# EAGLE schematic bms_108_Cell (EAGLE 6.2), part 2 of 2
## Sheet 7 of 9
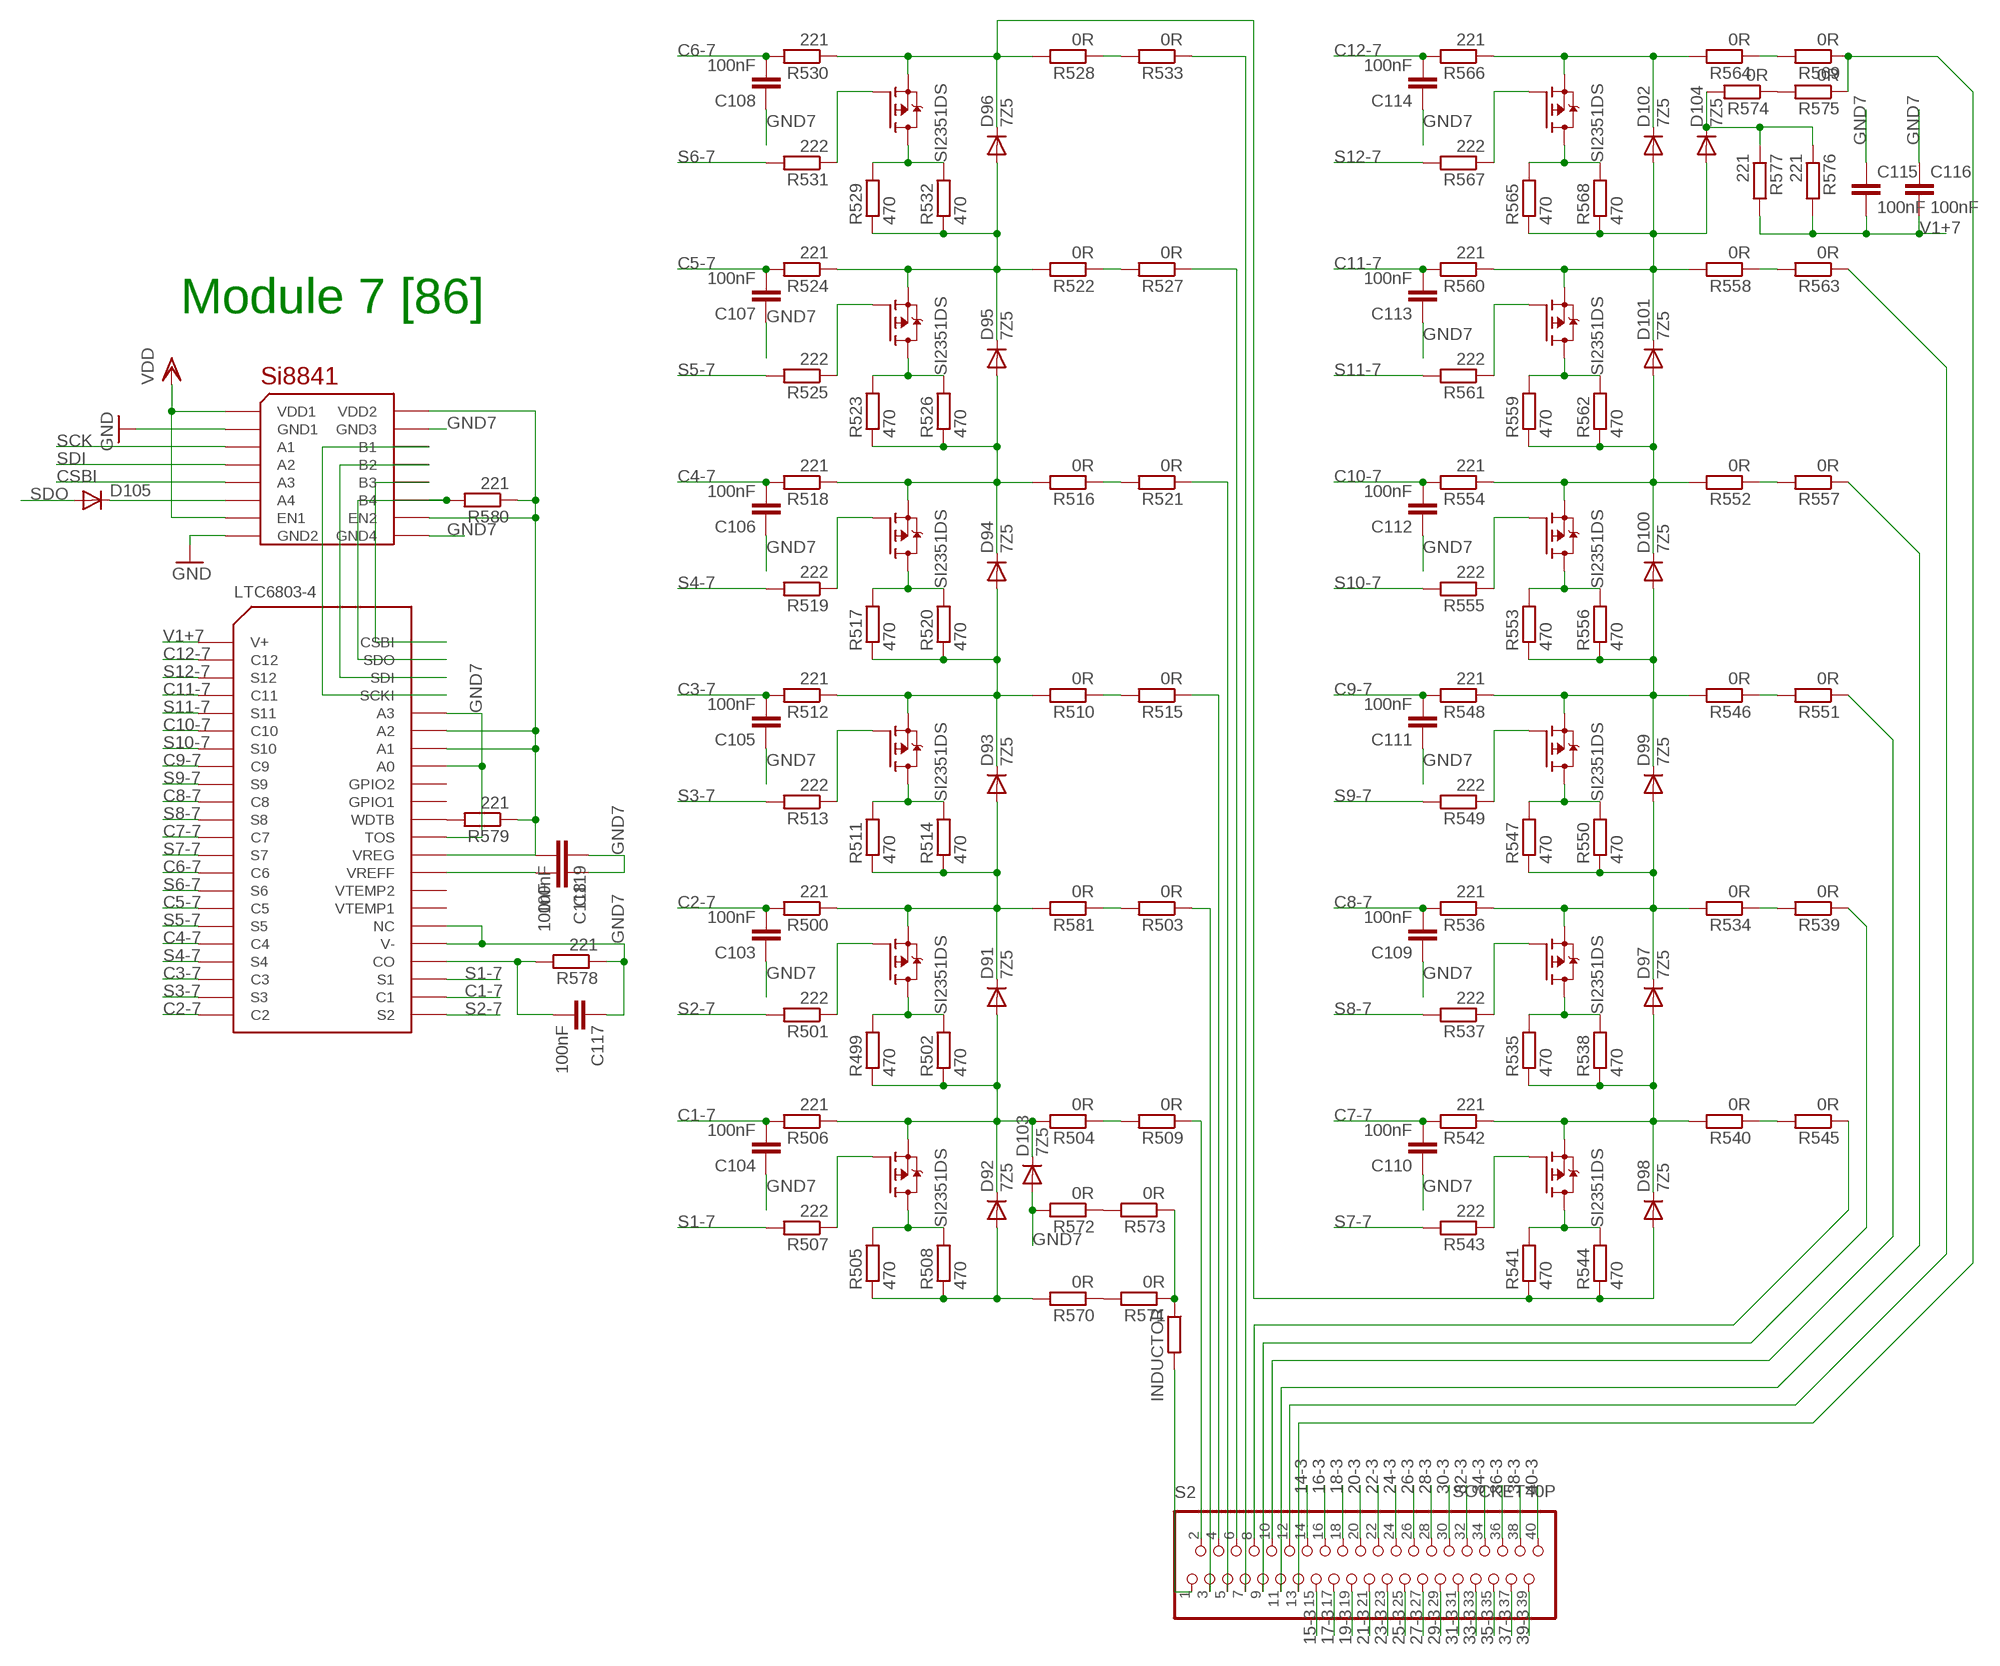
[diagram p6: schematic, sheet 7]

### Parts
C103  100nF  C-EUC0805K  [C0805K]
C104  100nF  C-EUC0805K  [C0805K]
C105  100nF  C-EUC0805K  [C0805K]
C106  100nF  C-EUC0805K  [C0805K]
C107  100nF  C-EUC0805K  [C0805K]
C108  100nF  C-EUC0805K  [C0805K]
C109  100nF  C-EUC0805K  [C0805K]
C110  100nF  C-EUC0805K  [C0805K]
C111  100nF  C-EUC0805K  [C0805K]
C112  100nF  C-EUC0805K  [C0805K]
C113  100nF  C-EUC0805K  [C0805K]
C114  100nF  C-EUC0805K  [C0805K]
C115  100nF  C-EUC0805K  [C0805K]
C116  100nF  C-EUC0805K  [C0805K]
C117  100nF  C-EUC0805K  [C0805K]
C118  100nF  C-EUC0805K  [C0805K]
C119  100nF  C-EUC0805K  [C0805K]
D91  7Z5  DIODE-SMB  [SMB]
D92  7Z5  DIODE-SMB  [SMB]
D93  7Z5  DIODE-SMB  [SMB]
D94  7Z5  DIODE-SMB  [SMB]
D95  7Z5  DIODE-SMB  [SMB]
D96  7Z5  DIODE-SMB  [SMB]
D97  7Z5  DIODE-SMB  [SMB]
D98  7Z5  DIODE-SMB  [SMB]
D99  7Z5  DIODE-SMB  [SMB]
D100  7Z5  DIODE-SMB  [SMB]
D101  7Z5  DIODE-SMB  [SMB]
D102  7Z5  DIODE-SMB  [SMB]
D103  7Z5  DIODE-SMB  [SMB]
D104  7Z5  DIODE-SMB  [SMB]
D105  DIODE-SOD123  [SOD123]
R499  470  R-EU_R6332  [R6332]
R500  221  R-EU_R0805  [R0805]
R501  222  R-EU_R0805  [R0805]
R502  470  R-EU_R6332  [R6332]
R503  0R  R-EU_M1206  [M1206]
R504  0R  R-EU_M1206  [M1206]
R505  470  R-EU_R6332  [R6332]
R506  221  R-EU_R0805  [R0805]
R507  222  R-EU_R0805  [R0805]
R508  470  R-EU_R6332  [R6332]
R509  0R  R-EU_M1206  [M1206]
R510  0R  R-EU_M1206  [M1206]
R511  470  R-EU_R6332  [R6332]
R512  221  R-EU_R0805  [R0805]
R513  222  R-EU_R0805  [R0805]
R514  470  R-EU_R6332  [R6332]
R515  0R  R-EU_M1206  [M1206]
R516  0R  R-EU_M1206  [M1206]
R517  470  R-EU_R6332  [R6332]
R518  221  R-EU_R0805  [R0805]
R519  222  R-EU_R0805  [R0805]
R520  470  R-EU_R6332  [R6332]
R521  0R  R-EU_M1206  [M1206]
R522  0R  R-EU_M1206  [M1206]
R523  470  R-EU_R6332  [R6332]
R524  221  R-EU_R0805  [R0805]
R525  222  R-EU_R0805  [R0805]
R526  470  R-EU_R6332  [R6332]
R527  0R  R-EU_M1206  [M1206]
R528  0R  R-EU_M1206  [M1206]
R529  470  R-EU_R6332  [R6332]
R530  221  R-EU_R0805  [R0805]
R531  222  R-EU_R0805  [R0805]
R532  470  R-EU_R6332  [R6332]
R533  0R  R-EU_M1206  [M1206]
R534  0R  R-EU_M1206  [M1206]
R535  470  R-EU_R6332  [R6332]
R536  221  R-EU_R0805  [R0805]
R537  222  R-EU_R0805  [R0805]
R538  470  R-EU_R6332  [R6332]
R539  0R  R-EU_M1206  [M1206]
R540  0R  R-EU_M1206  [M1206]
R541  470  R-EU_R6332  [R6332]
R542  221  R-EU_R0805  [R0805]
R543  222  R-EU_R0805  [R0805]
R544  470  R-EU_R6332  [R6332]
R545  0R  R-EU_M1206  [M1206]
R546  0R  R-EU_M1206  [M1206]
R547  470  R-EU_R6332  [R6332]
R548  221  R-EU_R0805  [R0805]
R549  222  R-EU_R0805  [R0805]
R550  470  R-EU_R6332  [R6332]
R551  0R  R-EU_M1206  [M1206]
R552  0R  R-EU_M1206  [M1206]
R553  470  R-EU_R6332  [R6332]
R554  221  R-EU_R0805  [R0805]
R555  222  R-EU_R0805  [R0805]
R556  470  R-EU_R6332  [R6332]
R557  0R  R-EU_M1206  [M1206]
R558  0R  R-EU_M1206  [M1206]
R559  470  R-EU_R6332  [R6332]
R560  221  R-EU_R0805  [R0805]
R561  222  R-EU_R0805  [R0805]
R562  470  R-EU_R6332  [R6332]
R563  0R  R-EU_M1206  [M1206]
R564  0R  R-EU_M1206  [M1206]
R565  470  R-EU_R6332  [R6332]
R566  221  R-EU_R0805  [R0805]
R567  222  R-EU_R0805  [R0805]
R568  470  R-EU_R6332  [R6332]
R569  0R  R-EU_M1206  [M1206]
R570  0R  R-EU_M1206  [M1206]
R571  0R  R-EU_M1206  [M1206]
R572  0R  R-EU_M1206  [M1206]
R573  0R  R-EU_M1206  [M1206]
R574  0R  R-EU_M1206  [M1206]
R575  0R  R-EU_M1206  [M1206]
R576  221  R-EU_R0805  [R0805]
R577  221  R-EU_R0805  [R0805]
R578  221  R-EU_R0805  [R0805]
R579  221  R-EU_R0805  [R0805]
R580  221  R-EU_R0805  [R0805]
R581  0R  R-EU_M1206  [M1206]
S2  SOCKET40P  [40PIN]
U$91  LTC6803-4  [SSOP44]
U$92  SI8841  [SO16]
U$93  SI2351DS  [SOT23]
U$94  SI2351DS  [SOT23]
U$95  SI2351DS  [SOT23]
U$96  SI2351DS  [SOT23]
U$97  SI2351DS  [SOT23]
U$98  SI2351DS  [SOT23]
U$99  SI2351DS  [SOT23]
U$100  SI2351DS  [SOT23]
U$101  SI2351DS  [SOT23]
U$102  SI2351DS  [SOT23]
U$103  SI2351DS  [SOT23]
U$104  SI2351DS  [SOT23]
U$105  INDUCTOR  [L2012C]

### Nets
14-3: S2.14 ; also sheet 8
15-3: S2.15 ; also sheet 8
16-3: S2.16 ; also sheet 8
17-3: S2.17 ; also sheet 8
18-3: S2.18 ; also sheet 8
19-3: S2.19 ; also sheet 8
20-3: S2.20 ; also sheet 8
21-3: S2.21 ; also sheet 8
22-3: S2.22 ; also sheet 8
23-3: S2.23 ; also sheet 8
24-3: S2.24 ; also sheet 8
25-3: S2.25 ; also sheet 8
26-3: S2.26 ; also sheet 8
27-3: S2.27
28-3: S2.28 ; also sheet 9
29-3: S2.29 ; also sheet 9
30-3: S2.30 ; also sheet 9
31-3: S2.31 ; also sheet 9
32-3: S2.32 ; also sheet 9
33-3: S2.33 ; also sheet 9
34-3: S2.34 ; also sheet 9
35-3: S2.35 ; also sheet 9
36-3: S2.36 ; also sheet 9
37-3: S2.37 ; also sheet 9
38-3: S2.38 ; also sheet 9
39-3: S2.39 ; also sheet 9
40-3: S2.40 ; also sheet 9
C1-7: C104.2 R506.2 U$91.24(C1)
C2-7: C103.2 R500.2 U$91.P$22(C2)
C3-7: C105.2 R512.2 U$91.P$20(C3)
C4-7: C106.2 R518.2 U$91.P$18(C4)
C5-7: C107.2 R524.2 U$91.P$16(C5)
C6-7: C108.2 R530.2 U$91.P$14(C6)
C7-7: C110.2 R542.2 U$91.P$12(C7)
C8-7: C109.2 R536.2 U$91.P$10(C8)
C9-7: C111.2 R548.2 U$91.P$8(C9)
C10-7: C112.2 R554.2 U$91.P$6(C10)
C11-7: C113.2 R560.2 U$91.P$4(C11)
C12-7: C114.2 R566.2 U$91.P$2(C12)
CSBI: U$92.5(A3) ; also sheet 1,2,3,4,5,6,8,9
GND: U$92.2(GND1) U$92.8(GND2) ; also sheet 1,2,3,4,5,6,8,9
GND7: C103.1 C104.1 C105.1 C106.1 C107.1 C108.1 C109.1 C110.1 C111.1 C112.1 C113.1 C114.1 C115.1 C116.1 C117.1 C118.1 C119.1 D103.A R572.2 R578.1 U$91.27(V-) U$91.28(NC) U$91.33(TOS) U$91.37(A0) U$91.40(A3) U$92.9(GND4) U$92.15(GND3)
N$405: R501.1 U$93.1(G)
N$406: R499.2 R502.2 U$93.3(D)
N$407: D91.A D92.C D103.C R499.1 R502.1 R504.2 R506.1 U$94.2(S)
N$408: R503.2 R581.1
N$409: R507.1 U$94.1(G)
N$410: R505.2 R508.2 U$94.3(D)
N$411: R504.1 R509.2
N$412: R513.1 U$95.1(G)
N$413: R511.2 R514.2 U$95.3(D)
N$414: D91.C D93.A R500.1 R511.1 R514.1 R581.2 U$93.2(S)
N$415: R510.1 R515.2
N$416: R519.1 U$96.1(G)
N$417: R517.2 R520.2 U$96.3(D)
N$418: D93.C D94.A R510.2 R512.1 R517.1 R520.1 U$95.2(S)
N$419: R516.1 R521.2
N$420: R525.1 U$97.1(G)
N$421: R523.2 R526.2 U$97.3(D)
N$422: D94.C D95.A R516.2 R518.1 R523.1 R526.1 U$96.2(S)
N$423: R522.1 R527.2
N$424: R531.1 U$98.1(G)
N$425: R529.2 R532.2 U$98.3(D)
N$426: D95.C D96.A R522.2 R524.1 R529.1 R532.1 U$97.2(S)
N$427: R528.1 R533.2
N$428: R537.1 U$99.1(G)
N$429: R535.2 R538.2 U$99.3(D)
N$430: D97.A D98.C R535.1 R538.1 R540.2 R542.1 U$100.2(S)
N$431: R534.1 R539.2
N$432: R543.1 U$100.1(G)
N$433: R541.2 R544.2 U$100.3(D)
N$434: D96.C D98.A R528.2 R530.1 R541.1 R544.1 U$98.2(S)
N$435: R540.1 R545.2
N$436: R549.1 U$101.1(G)
N$437: R547.2 R550.2 U$101.3(D)
N$438: D97.C D99.A R534.2 R536.1 R547.1 R550.1 U$99.2(S)
N$439: R546.1 R551.2
N$440: R555.1 U$102.1(G)
N$441: R553.2 R556.2 U$102.3(D)
N$442: D99.C D100.A R546.2 R548.1 R553.1 R556.1 U$101.2(S)
N$443: R552.1 R557.2
N$444: R561.1 U$103.1(G)
N$445: R559.2 R562.2 U$103.3(D)
N$446: D100.C D101.A R552.2 R554.1 R559.1 R562.1 U$102.2(S)
N$447: R558.1 R563.2
N$448: D102.C R564.2 R566.1 U$104.2(S)
N$449: R567.1 U$104.1(G)
N$450: R565.2 R568.2 U$104.3(D)
N$451: D101.C D102.A D104.A R558.2 R560.1 R565.1 R568.1 U$103.2(S)
N$452: R564.1 R569.2
N$453: R570.1 R571.2
N$454: R571.1 R573.1 U$105.1
N$455: D92.A R505.1 R508.1 R570.2
N$456: R572.1 R573.2
N$457: R574.1 R575.2
N$458: D104.C R574.2 R576.1 R577.1
N$459: R569.1 R575.1 S2.13
N$460: C117.2 R578.2 U$91.26(CO)
N$461: C118.2 U$91.31(VREFF)
N$462: C119.2 R579.1 R580.1 U$91.32(VREG) U$91.38(A1) U$91.39(A2) U$92.10(EN2) U$92.16(VDD2)
N$463: R579.2 U$91.34(WDTB)
N$464: R580.2 U$91.43(SDO) U$92.11(B4)
N$465: U$91.44(CSBI) U$92.12(B3)
N$466: U$91.42(SDI) U$92.13(B2)
N$467: U$91.41(SCKI) U$92.14(B1)
N$468: S2.1 U$105.2
N$469: R509.1 S2.2
N$470: R503.1 S2.3
N$471: R515.1 S2.4
N$472: R521.1 S2.5
N$473: R527.1 S2.6
N$474: R533.1 S2.7
N$475: R545.1 S2.8
N$476: R539.1 S2.9
N$477: R551.1 S2.10
N$478: R557.1 S2.11
N$479: R563.1 S2.12
N$480: D105.C U$92.6(A4)
S1-7: R507.2 U$91.25(S1)
S2-7: R501.2 U$91.23(S2)
S3-7: R513.2 U$91.P$21(S3)
S4-7: R519.2 U$91.P$19(S4)
S5-7: R525.2 U$91.P$17(S5)
S6-7: R531.2 U$91.P$15(S6)
S7-7: R543.2 U$91.P$13(S7)
S8-7: R537.2 U$91.P$11(S8)
S9-7: R549.2 U$91.P$9(S9)
S10-7: R555.2 U$91.P$7(S10)
S11-7: R561.2 U$91.P$5(S11)
S12-7: R567.2 U$91.P$3(S12)
SCK: U$92.3(A1) ; also sheet 1,2,3,4,5,6,8,9
SDI: U$92.4(A2) ; also sheet 1,2,3,4,5,6,8,9
SDO: D105.A ; also sheet 1,2,3,4,5,6,8,9
V1+7: C115.2 C116.2 R576.2 R577.2 U$91.P$1(V+)
VDD: U$92.1(VDD1) U$92.7(EN1) ; also sheet 1,2,3,4,5,6,8,9
Unconnected: U$91.29(VTEMP1) U$91.30(VTEMP2) U$91.35(GPIO1) U$91.36(GPIO2)

### Notes on the sheet
- Module 7 [86]

## Sheet 8 of 9
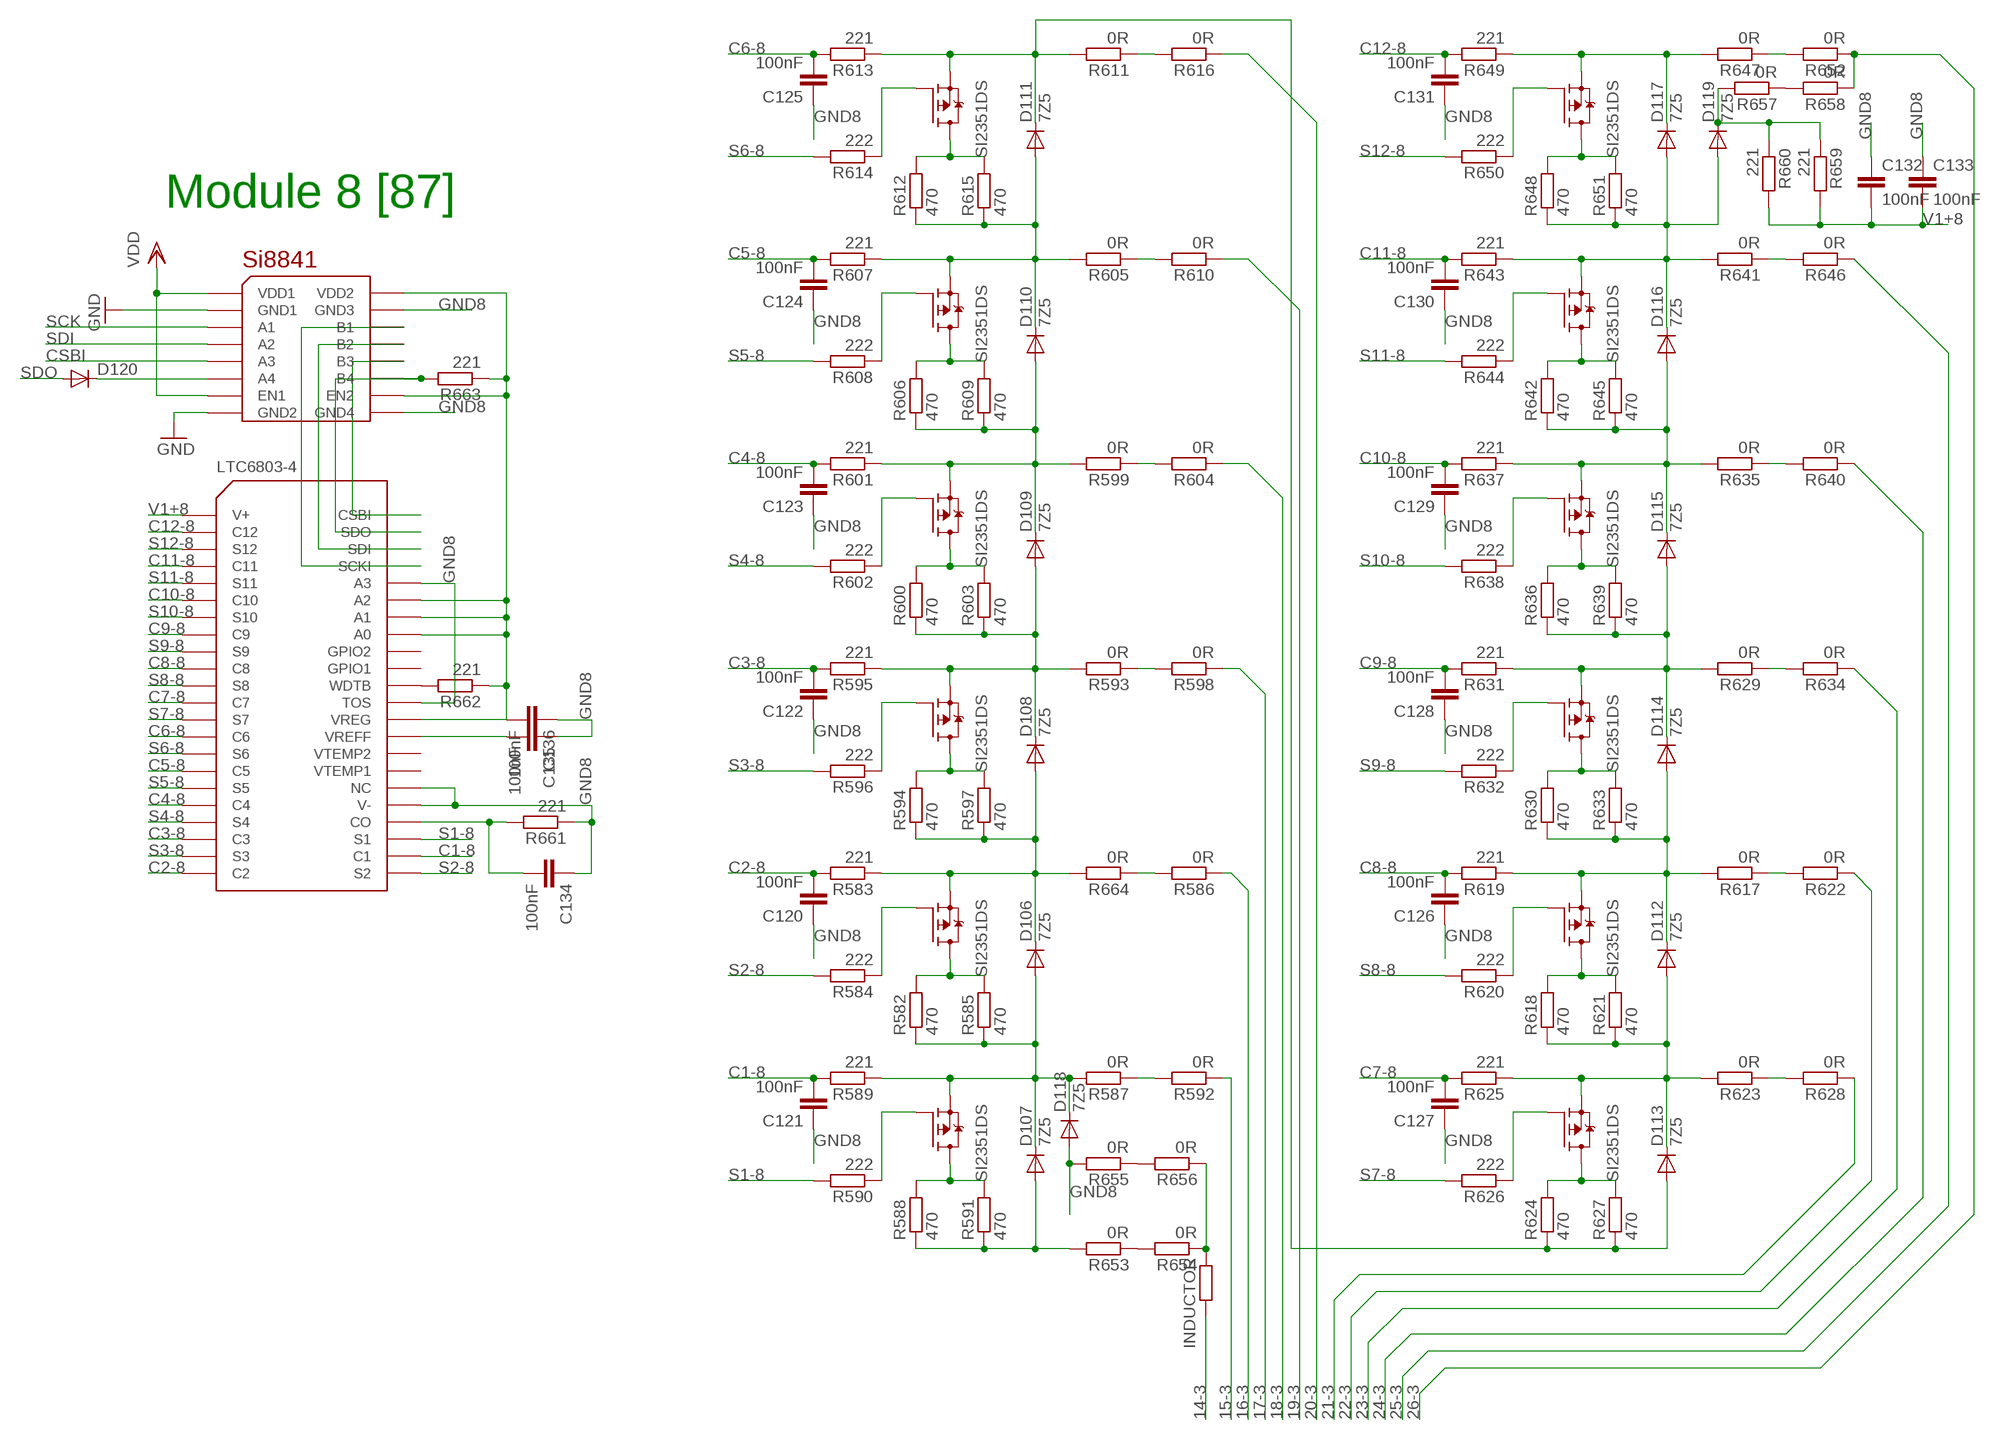
[diagram p7: schematic, sheet 8]

### Parts
C120  100nF  C-EUC0805K  [C0805K]
C121  100nF  C-EUC0805K  [C0805K]
C122  100nF  C-EUC0805K  [C0805K]
C123  100nF  C-EUC0805K  [C0805K]
C124  100nF  C-EUC0805K  [C0805K]
C125  100nF  C-EUC0805K  [C0805K]
C126  100nF  C-EUC0805K  [C0805K]
C127  100nF  C-EUC0805K  [C0805K]
C128  100nF  C-EUC0805K  [C0805K]
C129  100nF  C-EUC0805K  [C0805K]
C130  100nF  C-EUC0805K  [C0805K]
C131  100nF  C-EUC0805K  [C0805K]
C132  100nF  C-EUC0805K  [C0805K]
C133  100nF  C-EUC0805K  [C0805K]
C134  100nF  C-EUC0805K  [C0805K]
C135  100nF  C-EUC0805K  [C0805K]
C136  100nF  C-EUC0805K  [C0805K]
D106  7Z5  DIODE-SMB  [SMB]
D107  7Z5  DIODE-SMB  [SMB]
D108  7Z5  DIODE-SMB  [SMB]
D109  7Z5  DIODE-SMB  [SMB]
D110  7Z5  DIODE-SMB  [SMB]
D111  7Z5  DIODE-SMB  [SMB]
D112  7Z5  DIODE-SMB  [SMB]
D113  7Z5  DIODE-SMB  [SMB]
D114  7Z5  DIODE-SMB  [SMB]
D115  7Z5  DIODE-SMB  [SMB]
D116  7Z5  DIODE-SMB  [SMB]
D117  7Z5  DIODE-SMB  [SMB]
D118  7Z5  DIODE-SMB  [SMB]
D119  7Z5  DIODE-SMB  [SMB]
D120  DIODE-SOD123  [SOD123]
R582  470  R-EU_R6332  [R6332]
R583  221  R-EU_R0805  [R0805]
R584  222  R-EU_R0805  [R0805]
R585  470  R-EU_R6332  [R6332]
R586  0R  R-EU_M1206  [M1206]
R587  0R  R-EU_M1206  [M1206]
R588  470  R-EU_R6332  [R6332]
R589  221  R-EU_R0805  [R0805]
R590  222  R-EU_R0805  [R0805]
R591  470  R-EU_R6332  [R6332]
R592  0R  R-EU_M1206  [M1206]
R593  0R  R-EU_M1206  [M1206]
R594  470  R-EU_R6332  [R6332]
R595  221  R-EU_R0805  [R0805]
R596  222  R-EU_R0805  [R0805]
R597  470  R-EU_R6332  [R6332]
R598  0R  R-EU_M1206  [M1206]
R599  0R  R-EU_M1206  [M1206]
R600  470  R-EU_R6332  [R6332]
R601  221  R-EU_R0805  [R0805]
R602  222  R-EU_R0805  [R0805]
R603  470  R-EU_R6332  [R6332]
R604  0R  R-EU_M1206  [M1206]
R605  0R  R-EU_M1206  [M1206]
R606  470  R-EU_R6332  [R6332]
R607  221  R-EU_R0805  [R0805]
R608  222  R-EU_R0805  [R0805]
R609  470  R-EU_R6332  [R6332]
R610  0R  R-EU_M1206  [M1206]
R611  0R  R-EU_M1206  [M1206]
R612  470  R-EU_R6332  [R6332]
R613  221  R-EU_R0805  [R0805]
R614  222  R-EU_R0805  [R0805]
R615  470  R-EU_R6332  [R6332]
R616  0R  R-EU_M1206  [M1206]
R617  0R  R-EU_M1206  [M1206]
R618  470  R-EU_R6332  [R6332]
R619  221  R-EU_R0805  [R0805]
R620  222  R-EU_R0805  [R0805]
R621  470  R-EU_R6332  [R6332]
R622  0R  R-EU_M1206  [M1206]
R623  0R  R-EU_M1206  [M1206]
R624  470  R-EU_R6332  [R6332]
R625  221  R-EU_R0805  [R0805]
R626  222  R-EU_R0805  [R0805]
R627  470  R-EU_R6332  [R6332]
R628  0R  R-EU_M1206  [M1206]
R629  0R  R-EU_M1206  [M1206]
R630  470  R-EU_R6332  [R6332]
R631  221  R-EU_R0805  [R0805]
R632  222  R-EU_R0805  [R0805]
R633  470  R-EU_R6332  [R6332]
R634  0R  R-EU_M1206  [M1206]
R635  0R  R-EU_M1206  [M1206]
R636  470  R-EU_R6332  [R6332]
R637  221  R-EU_R0805  [R0805]
R638  222  R-EU_R0805  [R0805]
R639  470  R-EU_R6332  [R6332]
R640  0R  R-EU_M1206  [M1206]
R641  0R  R-EU_M1206  [M1206]
R642  470  R-EU_R6332  [R6332]
R643  221  R-EU_R0805  [R0805]
R644  222  R-EU_R0805  [R0805]
R645  470  R-EU_R6332  [R6332]
R646  0R  R-EU_M1206  [M1206]
R647  0R  R-EU_M1206  [M1206]
R648  470  R-EU_R6332  [R6332]
R649  221  R-EU_R0805  [R0805]
R650  222  R-EU_R0805  [R0805]
R651  470  R-EU_R6332  [R6332]
R652  0R  R-EU_M1206  [M1206]
R653  0R  R-EU_M1206  [M1206]
R654  0R  R-EU_M1206  [M1206]
R655  0R  R-EU_M1206  [M1206]
R656  0R  R-EU_M1206  [M1206]
R657  0R  R-EU_M1206  [M1206]
R658  0R  R-EU_M1206  [M1206]
R659  221  R-EU_R0805  [R0805]
R660  221  R-EU_R0805  [R0805]
R661  221  R-EU_R0805  [R0805]
R662  221  R-EU_R0805  [R0805]
R663  221  R-EU_R0805  [R0805]
R664  0R  R-EU_M1206  [M1206]
U$106  LTC6803-4  [SSOP44]
U$107  SI8841  [SO16]
U$108  SI2351DS  [SOT23]
U$109  SI2351DS  [SOT23]
U$110  SI2351DS  [SOT23]
U$111  SI2351DS  [SOT23]
U$112  SI2351DS  [SOT23]
U$113  SI2351DS  [SOT23]
U$114  SI2351DS  [SOT23]
U$115  SI2351DS  [SOT23]
U$116  SI2351DS  [SOT23]
U$117  SI2351DS  [SOT23]
U$118  SI2351DS  [SOT23]
U$119  SI2351DS  [SOT23]
U$120  INDUCTOR  [L2012C]

### Nets
14-3: U$120.2 ; also sheet 7
15-3: R592.1 ; also sheet 7
16-3: R586.1 ; also sheet 7
17-3: R598.1 ; also sheet 7
18-3: R604.1 ; also sheet 7
19-3: R610.1 ; also sheet 7
20-3: R616.1 ; also sheet 7
21-3: R628.1 ; also sheet 7
22-3: R622.1 ; also sheet 7
23-3: R634.1 ; also sheet 7
24-3: R640.1 ; also sheet 7
25-3: R646.1 ; also sheet 7
26-3: R652.1 R658.1 ; also sheet 7
C1-8: C121.2 R589.2 U$106.24(C1)
C2-8: C120.2 R583.2 U$106.P$22(C2)
C3-8: C122.2 R595.2 U$106.P$20(C3)
C4-8: C123.2 R601.2 U$106.P$18(C4)
C5-8: C124.2 R607.2 U$106.P$16(C5)
C6-8: C125.2 R613.2 U$106.P$14(C6)
C7-8: C127.2 R625.2 U$106.P$12(C7)
C8-8: C126.2 R619.2 U$106.P$10(C8)
C9-8: C128.2 R631.2 U$106.P$8(C9)
C10-8: C129.2 R637.2 U$106.P$6(C10)
C11-8: C130.2 R643.2 U$106.P$4(C11)
C12-8: C131.2 R649.2 U$106.P$2(C12)
CSBI: U$107.5(A3) ; also sheet 1,2,3,4,5,6,7,9
GND: U$107.2(GND1) U$107.8(GND2) ; also sheet 1,2,3,4,5,6,7,9
GND8: C120.1 C121.1 C122.1 C123.1 C124.1 C125.1 C126.1 C127.1 C128.1 C129.1 C130.1 C131.1 C132.1 C133.1 C134.1 C135.1 C136.1 D118.A R655.2 R661.1 U$106.27(V-) U$106.28(NC) U$106.33(TOS) U$106.40(A3) U$107.9(GND4) U$107.15(GND3)
N$481: R584.1 U$108.1(G)
N$482: R582.2 R585.2 U$108.3(D)
N$483: D106.A D107.C D118.C R582.1 R585.1 R587.2 R589.1 U$109.2(S)
N$484: R586.2 R664.1
N$485: R590.1 U$109.1(G)
N$486: R588.2 R591.2 U$109.3(D)
N$487: R587.1 R592.2
N$488: R596.1 U$110.1(G)
N$489: R594.2 R597.2 U$110.3(D)
N$490: D106.C D108.A R583.1 R594.1 R597.1 R664.2 U$108.2(S)
N$491: R593.1 R598.2
N$492: R602.1 U$111.1(G)
N$493: R600.2 R603.2 U$111.3(D)
N$494: D108.C D109.A R593.2 R595.1 R600.1 R603.1 U$110.2(S)
N$495: R599.1 R604.2
N$496: R608.1 U$112.1(G)
N$497: R606.2 R609.2 U$112.3(D)
N$498: D109.C D110.A R599.2 R601.1 R606.1 R609.1 U$111.2(S)
N$499: R605.1 R610.2
N$500: R614.1 U$113.1(G)
N$501: R612.2 R615.2 U$113.3(D)
N$502: D110.C D111.A R605.2 R607.1 R612.1 R615.1 U$112.2(S)
N$503: R611.1 R616.2
N$504: R620.1 U$114.1(G)
N$505: R618.2 R621.2 U$114.3(D)
N$506: D112.A D113.C R618.1 R621.1 R623.2 R625.1 U$115.2(S)
N$507: R617.1 R622.2
N$508: R626.1 U$115.1(G)
N$509: R624.2 R627.2 U$115.3(D)
N$510: D111.C D113.A R611.2 R613.1 R624.1 R627.1 U$113.2(S)
N$511: R623.1 R628.2
N$512: R632.1 U$116.1(G)
N$513: R630.2 R633.2 U$116.3(D)
N$514: D112.C D114.A R617.2 R619.1 R630.1 R633.1 U$114.2(S)
N$515: R629.1 R634.2
N$516: R638.1 U$117.1(G)
N$517: R636.2 R639.2 U$117.3(D)
N$518: D114.C D115.A R629.2 R631.1 R636.1 R639.1 U$116.2(S)
N$519: R635.1 R640.2
N$520: R644.1 U$118.1(G)
N$521: R642.2 R645.2 U$118.3(D)
N$522: D115.C D116.A R635.2 R637.1 R642.1 R645.1 U$117.2(S)
N$523: R641.1 R646.2
N$524: D117.C R647.2 R649.1 U$119.2(S)
N$525: R650.1 U$119.1(G)
N$526: R648.2 R651.2 U$119.3(D)
N$527: D116.C D117.A D119.A R641.2 R643.1 R648.1 R651.1 U$118.2(S)
N$528: R647.1 R652.2
N$529: R653.1 R654.2
N$530: R654.1 R656.1 U$120.1
N$531: D107.A R588.1 R591.1 R653.2
N$532: R655.1 R656.2
N$533: R657.1 R658.2
N$534: D119.C R657.2 R659.1 R660.1
N$535: C134.2 R661.2 U$106.26(CO)
N$536: C135.2 U$106.31(VREFF)
N$537: C136.2 R662.1 R663.1 U$106.32(VREG) U$106.37(A0) U$106.38(A1) U$106.39(A2) U$107.10(EN2) U$107.16(VDD2)
N$538: R662.2 U$106.34(WDTB)
N$539: R663.2 U$106.43(SDO) U$107.11(B4)
N$540: U$106.44(CSBI) U$107.12(B3)
N$541: U$106.42(SDI) U$107.13(B2)
N$542: U$106.41(SCKI) U$107.14(B1)
N$543: D120.C U$107.6(A4)
S1-8: R590.2 U$106.25(S1)
S2-8: R584.2 U$106.23(S2)
S3-8: R596.2 U$106.P$21(S3)
S4-8: R602.2 U$106.P$19(S4)
S5-8: R608.2 U$106.P$17(S5)
S6-8: R614.2 U$106.P$15(S6)
S7-8: R626.2 U$106.P$13(S7)
S8-8: R620.2 U$106.P$11(S8)
S9-8: R632.2 U$106.P$9(S9)
S10-8: R638.2 U$106.P$7(S10)
S11-8: R644.2 U$106.P$5(S11)
S12-8: R650.2 U$106.P$3(S12)
SCK: U$107.3(A1) ; also sheet 1,2,3,4,5,6,7,9
SDI: U$107.4(A2) ; also sheet 1,2,3,4,5,6,7,9
SDO: D120.A ; also sheet 1,2,3,4,5,6,7,9
V1+8: C132.2 C133.2 R659.2 R660.2 U$106.P$1(V+)
VDD: U$107.1(VDD1) U$107.7(EN1) ; also sheet 1,2,3,4,5,6,7,9
Unconnected: U$106.29(VTEMP1) U$106.30(VTEMP2) U$106.35(GPIO1) U$106.36(GPIO2)

### Notes on the sheet
- Module 8 [87]

## Sheet 9 of 9
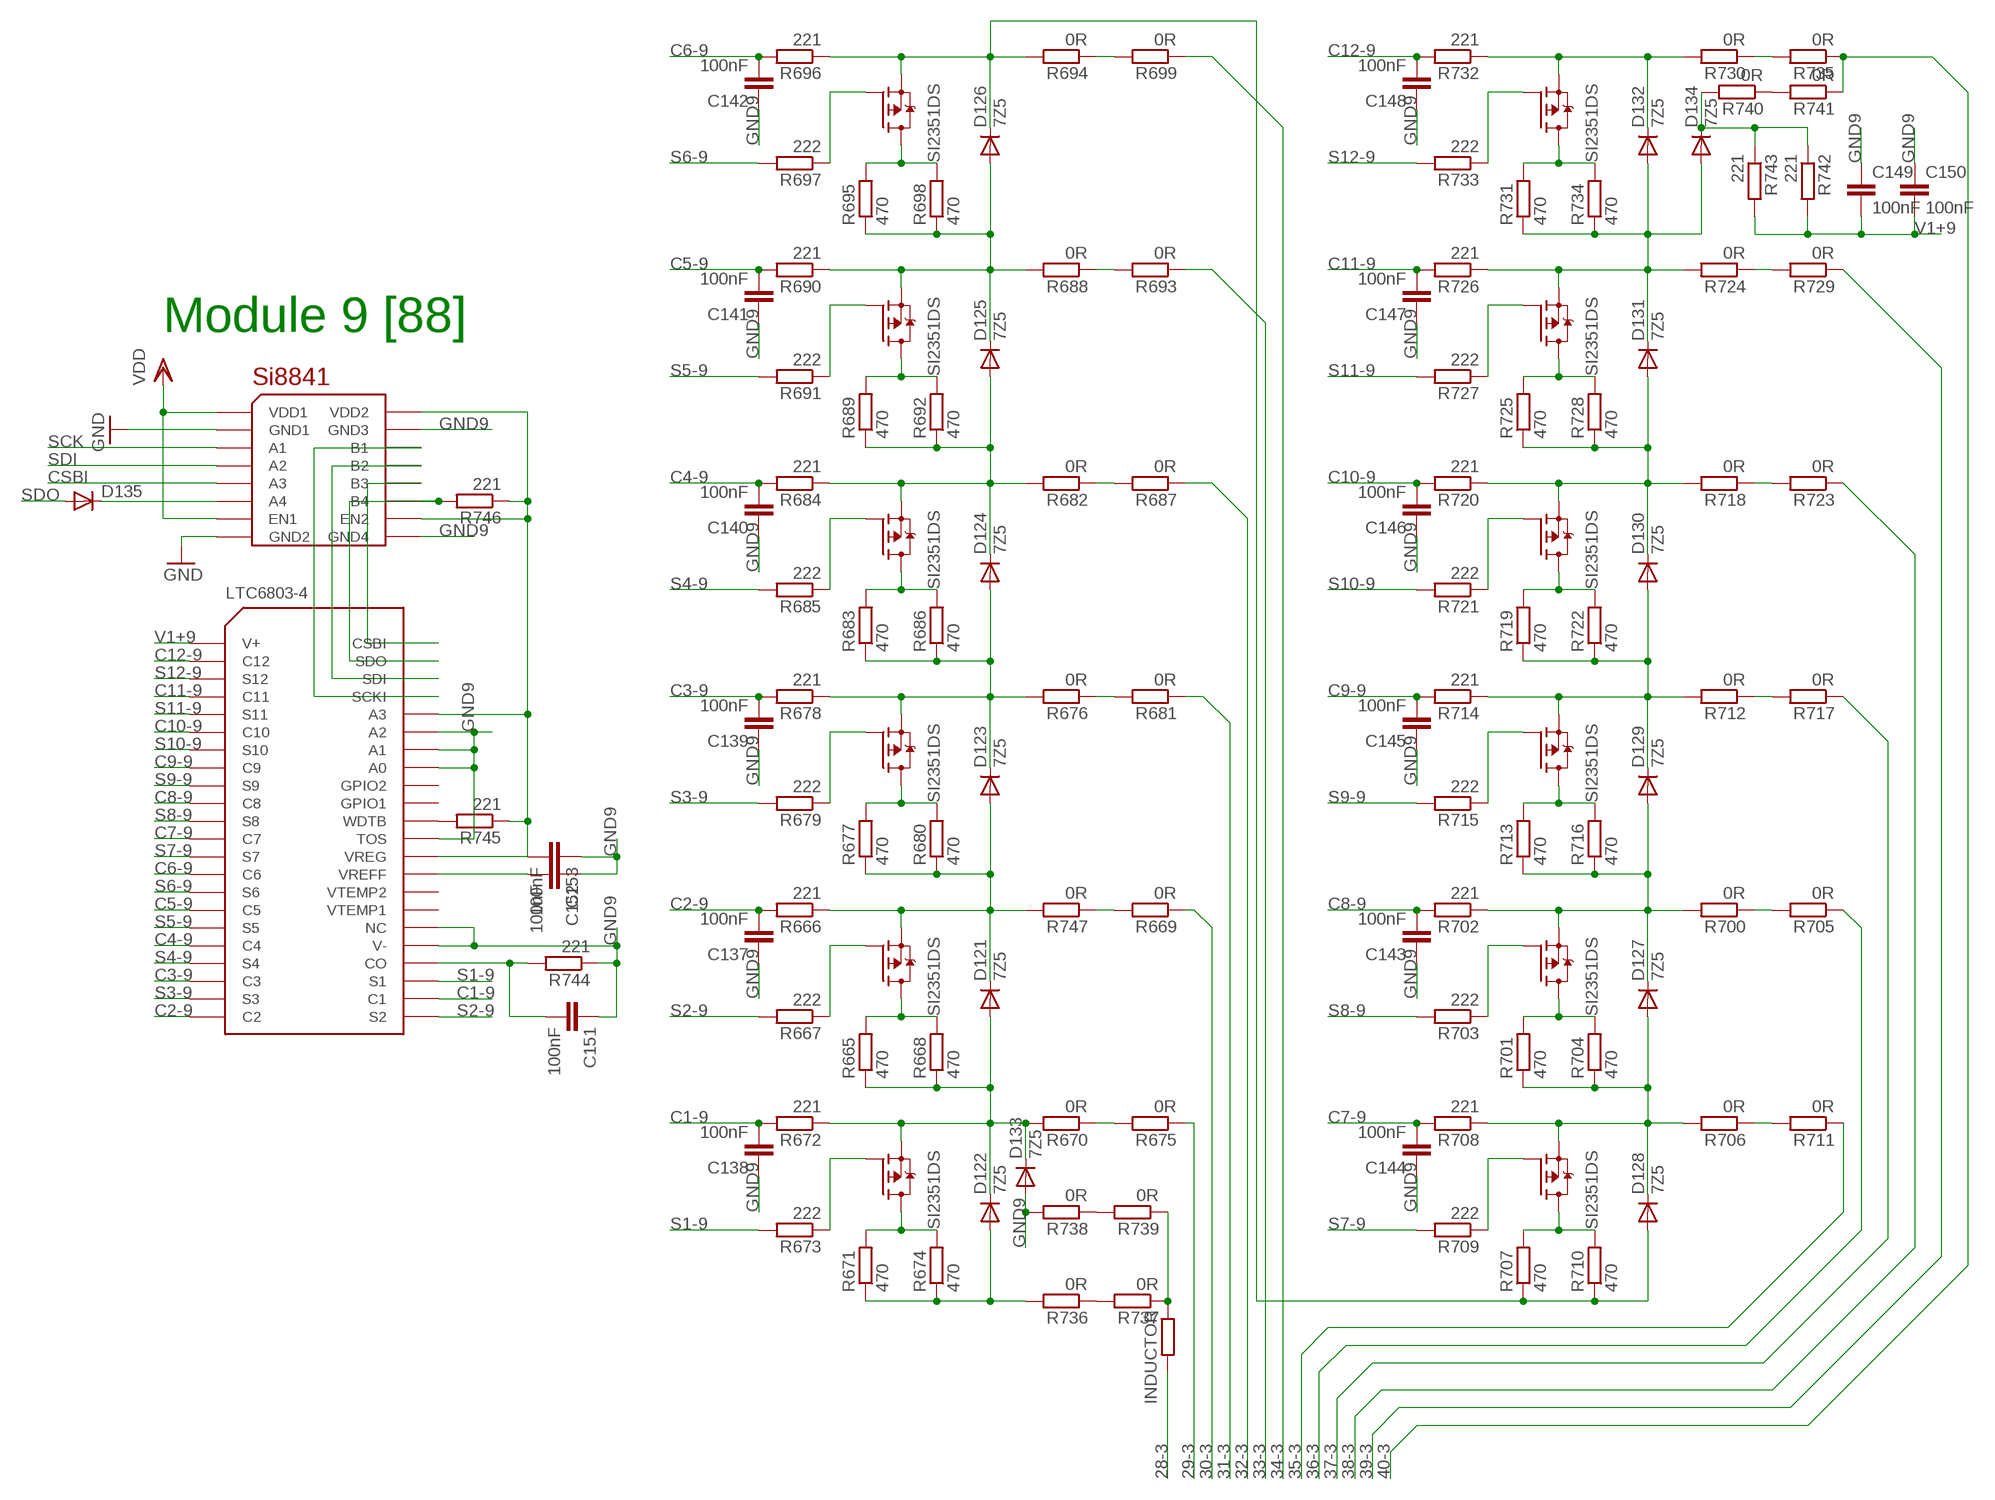
[diagram p8: schematic, sheet 9]

### Parts
C137  100nF  C-EUC0805K  [C0805K]
C138  100nF  C-EUC0805K  [C0805K]
C139  100nF  C-EUC0805K  [C0805K]
C140  100nF  C-EUC0805K  [C0805K]
C141  100nF  C-EUC0805K  [C0805K]
C142  100nF  C-EUC0805K  [C0805K]
C143  100nF  C-EUC0805K  [C0805K]
C144  100nF  C-EUC0805K  [C0805K]
C145  100nF  C-EUC0805K  [C0805K]
C146  100nF  C-EUC0805K  [C0805K]
C147  100nF  C-EUC0805K  [C0805K]
C148  100nF  C-EUC0805K  [C0805K]
C149  100nF  C-EUC0805K  [C0805K]
C150  100nF  C-EUC0805K  [C0805K]
C151  100nF  C-EUC0805K  [C0805K]
C152  100nF  C-EUC0805K  [C0805K]
C153  100nF  C-EUC0805K  [C0805K]
D121  7Z5  DIODE-SMB  [SMB]
D122  7Z5  DIODE-SMB  [SMB]
D123  7Z5  DIODE-SMB  [SMB]
D124  7Z5  DIODE-SMB  [SMB]
D125  7Z5  DIODE-SMB  [SMB]
D126  7Z5  DIODE-SMB  [SMB]
D127  7Z5  DIODE-SMB  [SMB]
D128  7Z5  DIODE-SMB  [SMB]
D129  7Z5  DIODE-SMB  [SMB]
D130  7Z5  DIODE-SMB  [SMB]
D131  7Z5  DIODE-SMB  [SMB]
D132  7Z5  DIODE-SMB  [SMB]
D133  7Z5  DIODE-SMB  [SMB]
D134  7Z5  DIODE-SMB  [SMB]
D135  DIODE-SOD123  [SOD123]
R665  470  R-EU_R6332  [R6332]
R666  221  R-EU_R0805  [R0805]
R667  222  R-EU_R0805  [R0805]
R668  470  R-EU_R6332  [R6332]
R669  0R  R-EU_M1206  [M1206]
R670  0R  R-EU_M1206  [M1206]
R671  470  R-EU_R6332  [R6332]
R672  221  R-EU_R0805  [R0805]
R673  222  R-EU_R0805  [R0805]
R674  470  R-EU_R6332  [R6332]
R675  0R  R-EU_M1206  [M1206]
R676  0R  R-EU_M1206  [M1206]
R677  470  R-EU_R6332  [R6332]
R678  221  R-EU_R0805  [R0805]
R679  222  R-EU_R0805  [R0805]
R680  470  R-EU_R6332  [R6332]
R681  0R  R-EU_M1206  [M1206]
R682  0R  R-EU_M1206  [M1206]
R683  470  R-EU_R6332  [R6332]
R684  221  R-EU_R0805  [R0805]
R685  222  R-EU_R0805  [R0805]
R686  470  R-EU_R6332  [R6332]
R687  0R  R-EU_M1206  [M1206]
R688  0R  R-EU_M1206  [M1206]
R689  470  R-EU_R6332  [R6332]
R690  221  R-EU_R0805  [R0805]
R691  222  R-EU_R0805  [R0805]
R692  470  R-EU_R6332  [R6332]
R693  0R  R-EU_M1206  [M1206]
R694  0R  R-EU_M1206  [M1206]
R695  470  R-EU_R6332  [R6332]
R696  221  R-EU_R0805  [R0805]
R697  222  R-EU_R0805  [R0805]
R698  470  R-EU_R6332  [R6332]
R699  0R  R-EU_M1206  [M1206]
R700  0R  R-EU_M1206  [M1206]
R701  470  R-EU_R6332  [R6332]
R702  221  R-EU_R0805  [R0805]
R703  222  R-EU_R0805  [R0805]
R704  470  R-EU_R6332  [R6332]
R705  0R  R-EU_M1206  [M1206]
R706  0R  R-EU_M1206  [M1206]
R707  470  R-EU_R6332  [R6332]
R708  221  R-EU_R0805  [R0805]
R709  222  R-EU_R0805  [R0805]
R710  470  R-EU_R6332  [R6332]
R711  0R  R-EU_M1206  [M1206]
R712  0R  R-EU_M1206  [M1206]
R713  470  R-EU_R6332  [R6332]
R714  221  R-EU_R0805  [R0805]
R715  222  R-EU_R0805  [R0805]
R716  470  R-EU_R6332  [R6332]
R717  0R  R-EU_M1206  [M1206]
R718  0R  R-EU_M1206  [M1206]
R719  470  R-EU_R6332  [R6332]
R720  221  R-EU_R0805  [R0805]
R721  222  R-EU_R0805  [R0805]
R722  470  R-EU_R6332  [R6332]
R723  0R  R-EU_M1206  [M1206]
R724  0R  R-EU_M1206  [M1206]
R725  470  R-EU_R6332  [R6332]
R726  221  R-EU_R0805  [R0805]
R727  222  R-EU_R0805  [R0805]
R728  470  R-EU_R6332  [R6332]
R729  0R  R-EU_M1206  [M1206]
R730  0R  R-EU_M1206  [M1206]
R731  470  R-EU_R6332  [R6332]
R732  221  R-EU_R0805  [R0805]
R733  222  R-EU_R0805  [R0805]
R734  470  R-EU_R6332  [R6332]
R735  0R  R-EU_M1206  [M1206]
R736  0R  R-EU_M1206  [M1206]
R737  0R  R-EU_M1206  [M1206]
R738  0R  R-EU_M1206  [M1206]
R739  0R  R-EU_M1206  [M1206]
R740  0R  R-EU_M1206  [M1206]
R741  0R  R-EU_M1206  [M1206]
R742  221  R-EU_R0805  [R0805]
R743  221  R-EU_R0805  [R0805]
R744  221  R-EU_R0805  [R0805]
R745  221  R-EU_R0805  [R0805]
R746  221  R-EU_R0805  [R0805]
R747  0R  R-EU_M1206  [M1206]
U$121  LTC6803-4  [SSOP44]
U$122  SI8841  [SO16]
U$123  SI2351DS  [SOT23]
U$124  SI2351DS  [SOT23]
U$125  SI2351DS  [SOT23]
U$126  SI2351DS  [SOT23]
U$127  SI2351DS  [SOT23]
U$128  SI2351DS  [SOT23]
U$129  SI2351DS  [SOT23]
U$130  SI2351DS  [SOT23]
U$131  SI2351DS  [SOT23]
U$132  SI2351DS  [SOT23]
U$133  SI2351DS  [SOT23]
U$134  SI2351DS  [SOT23]
U$135  INDUCTOR  [L2012C]

### Nets
28-3: U$135.2 ; also sheet 7
29-3: R675.1 ; also sheet 7
30-3: R669.1 ; also sheet 7
31-3: R681.1 ; also sheet 7
32-3: R687.1 ; also sheet 7
33-3: R693.1 ; also sheet 7
34-3: R699.1 ; also sheet 7
35-3: R711.1 ; also sheet 7
36-3: R705.1 ; also sheet 7
37-3: R717.1 ; also sheet 7
38-3: R723.1 ; also sheet 7
39-3: R729.1 ; also sheet 7
40-3: R735.1 R741.1 ; also sheet 7
C1-9: C138.2 R672.2 U$121.24(C1)
C2-9: C137.2 R666.2 U$121.P$22(C2)
C3-9: C139.2 R678.2 U$121.P$20(C3)
C4-9: C140.2 R684.2 U$121.P$18(C4)
C5-9: C141.2 R690.2 U$121.P$16(C5)
C6-9: C142.2 R696.2 U$121.P$14(C6)
C7-9: C144.2 R708.2 U$121.P$12(C7)
C8-9: C143.2 R702.2 U$121.P$10(C8)
C9-9: C145.2 R714.2 U$121.P$8(C9)
C10-9: C146.2 R720.2 U$121.P$6(C10)
C11-9: C147.2 R726.2 U$121.P$4(C11)
C12-9: C148.2 R732.2 U$121.P$2(C12)
CSBI: U$122.5(A3) ; also sheet 1,2,3,4,5,6,7,8
GND: U$122.2(GND1) U$122.8(GND2) ; also sheet 1,2,3,4,5,6,7,8
GND9: C137.1 C138.1 C139.1 C140.1 C141.1 C142.1 C143.1 C144.1 C145.1 C146.1 C147.1 C148.1 C149.1 C150.1 C151.1 C152.1 C153.1 D133.A R738.2 R744.1 U$121.27(V-) U$121.28(NC) U$121.33(TOS) U$121.37(A0) U$121.38(A1) U$121.39(A2) U$122.9(GND4) U$122.15(GND3)
N$545: R667.1 U$123.1(G)
N$546: R665.2 R668.2 U$123.3(D)
N$547: D121.A D122.C D133.C R665.1 R668.1 R670.2 R672.1 U$124.2(S)
N$548: R669.2 R747.1
N$549: R673.1 U$124.1(G)
N$550: R671.2 R674.2 U$124.3(D)
N$551: R670.1 R675.2
N$552: R679.1 U$125.1(G)
N$553: R677.2 R680.2 U$125.3(D)
N$554: D121.C D123.A R666.1 R677.1 R680.1 R747.2 U$123.2(S)
N$555: R676.1 R681.2
N$556: R685.1 U$126.1(G)
N$557: R683.2 R686.2 U$126.3(D)
N$558: D123.C D124.A R676.2 R678.1 R683.1 R686.1 U$125.2(S)
N$559: R682.1 R687.2
N$560: R691.1 U$127.1(G)
N$561: R689.2 R692.2 U$127.3(D)
N$562: D124.C D125.A R682.2 R684.1 R689.1 R692.1 U$126.2(S)
N$563: R688.1 R693.2
N$564: R697.1 U$128.1(G)
N$565: R695.2 R698.2 U$128.3(D)
N$566: D125.C D126.A R688.2 R690.1 R695.1 R698.1 U$127.2(S)
N$567: R694.1 R699.2
N$568: R703.1 U$129.1(G)
N$569: R701.2 R704.2 U$129.3(D)
N$570: D127.A D128.C R701.1 R704.1 R706.2 R708.1 U$130.2(S)
N$571: R700.1 R705.2
N$572: R709.1 U$130.1(G)
N$573: R707.2 R710.2 U$130.3(D)
N$574: D126.C D128.A R694.2 R696.1 R707.1 R710.1 U$128.2(S)
N$575: R706.1 R711.2
N$576: R715.1 U$131.1(G)
N$577: R713.2 R716.2 U$131.3(D)
N$578: D127.C D129.A R700.2 R702.1 R713.1 R716.1 U$129.2(S)
N$579: R712.1 R717.2
N$580: R721.1 U$132.1(G)
N$581: R719.2 R722.2 U$132.3(D)
N$582: D129.C D130.A R712.2 R714.1 R719.1 R722.1 U$131.2(S)
N$583: R718.1 R723.2
N$584: R727.1 U$133.1(G)
N$585: R725.2 R728.2 U$133.3(D)
N$586: D130.C D131.A R718.2 R720.1 R725.1 R728.1 U$132.2(S)
N$587: R724.1 R729.2
N$588: D132.C R730.2 R732.1 U$134.2(S)
N$589: R733.1 U$134.1(G)
N$590: R731.2 R734.2 U$134.3(D)
N$591: D131.C D132.A D134.A R724.2 R726.1 R731.1 R734.1 U$133.2(S)
N$592: R730.1 R735.2
N$593: R736.1 R737.2
N$594: R737.1 R739.1 U$135.1
N$595: D122.A R671.1 R674.1 R736.2
N$596: R738.1 R739.2
N$597: R740.1 R741.2
N$598: D134.C R740.2 R742.1 R743.1
N$599: C151.2 R744.2 U$121.26(CO)
N$600: C152.2 U$121.31(VREFF)
N$601: C153.2 R745.1 R746.1 U$121.32(VREG) U$121.40(A3) U$122.10(EN2) U$122.16(VDD2)
N$602: R745.2 U$121.34(WDTB)
N$603: R746.2 U$121.43(SDO) U$122.11(B4)
N$604: U$121.44(CSBI) U$122.12(B3)
N$605: U$121.42(SDI) U$122.13(B2)
N$606: U$121.41(SCKI) U$122.14(B1)
N$607: D135.C U$122.6(A4)
S1-9: R673.2 U$121.25(S1)
S2-9: R667.2 U$121.23(S2)
S3-9: R679.2 U$121.P$21(S3)
S4-9: R685.2 U$121.P$19(S4)
S5-9: R691.2 U$121.P$17(S5)
S6-9: R697.2 U$121.P$15(S6)
S7-9: R709.2 U$121.P$13(S7)
S8-9: R703.2 U$121.P$11(S8)
S9-9: R715.2 U$121.P$9(S9)
S10-9: R721.2 U$121.P$7(S10)
S11-9: R727.2 U$121.P$5(S11)
S12-9: R733.2 U$121.P$3(S12)
SCK: U$122.3(A1) ; also sheet 1,2,3,4,5,6,7,8
SDI: U$122.4(A2) ; also sheet 1,2,3,4,5,6,7,8
SDO: D135.A ; also sheet 1,2,3,4,5,6,7,8
V1+9: C149.2 C150.2 R742.2 R743.2 U$121.P$1(V+)
VDD: U$122.1(VDD1) U$122.7(EN1) ; also sheet 1,2,3,4,5,6,7,8
Unconnected: U$121.29(VTEMP1) U$121.30(VTEMP2) U$121.35(GPIO1) U$121.36(GPIO2)

### Notes on the sheet
- Module 9 [88]

## Library data of the parts
C1-C153 = resistor:C-EU: CAPACITOR, European symbol
D1-D135 = diode:DIODE-: DIODE
JP1 = pinhead:PINHD-1X6: PIN HEADER
R1-R747 = resistor:R-EU_: RESISTOR, European symbol
S S1 S2 = bms_gesits:SOCKET40P
U$1 U$16 U$31 U$34 U$61 U$76 U$91 U$106 U$121 = bms_gesits:LTC6803-4
U$2 U$17 U$32 U$35 U$62 U$77 U$92 U$107 U$122 = bms_gesits:SI8841
U$3-U$14 U$18-U$29 U$33 U$36-U$49 U$51-U$59 U$63-U$74 U$78-U$89 U$93-U$104 U$108-U$119 U$123-U$134 = bms_gesits:SI2351DS
U$15 U$30 U$50 U$60 U$75 U$90 U$105 U$120 U$135 = bms_gesits:INDUCTOR